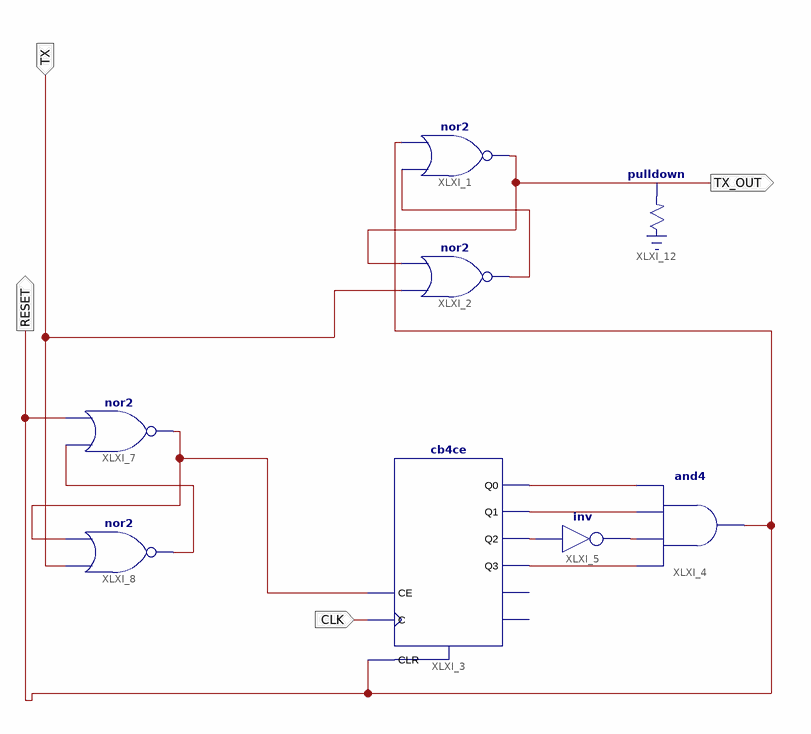
[diagram p0: schematic sheet 1]
// Xilinx ISE schematic LOGIC_INPUT.sch (spartan3e) as structural Verilog: 8 symbols, 4 ports
module LOGIC_INPUT (
  input  CLK,
  input  TX,
  output TX_OUT,
  output RESET
);

  wire XLXN_3, XLXN_5, XLXN_6, XLXN_7, XLXN_8, XLXN_9, XLXN_11, XLXN_12;

  nor XLXI_1 (TX_OUT, XLXN_3, RESET);
  nor XLXI_2 (XLXN_3, TX, TX_OUT);
  cb4ce XLXI_3 (
    .C(CLK), .CE(XLXN_11), .CLR(RESET), .Q0(XLXN_5), .Q1(XLXN_6), .Q2(XLXN_7), .Q3(XLXN_9));  // open: CEO, TC
  and XLXI_4 (RESET, XLXN_9, XLXN_8, XLXN_6, XLXN_5);
  not XLXI_5 (XLXN_8, XLXN_7);
  nor XLXI_7 (XLXN_11, XLXN_12, RESET);
  nor XLXI_8 (XLXN_12, TX, XLXN_11);
  \pulldown  XLXI_12 (.O(TX_OUT));
endmodule
